# EasyEDA Pro project 赛博樱花灯.epro, board PCB2_1
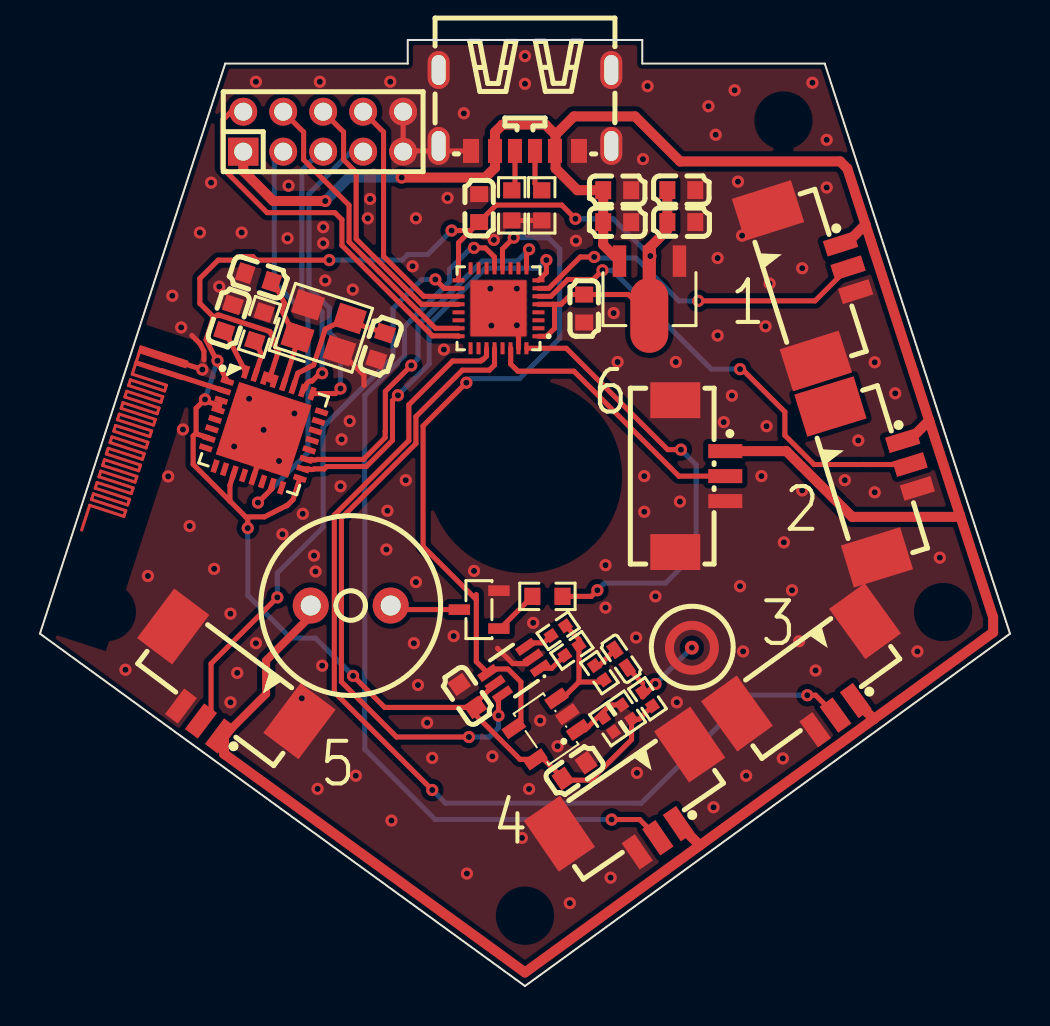
[diagram p14: board, top side]
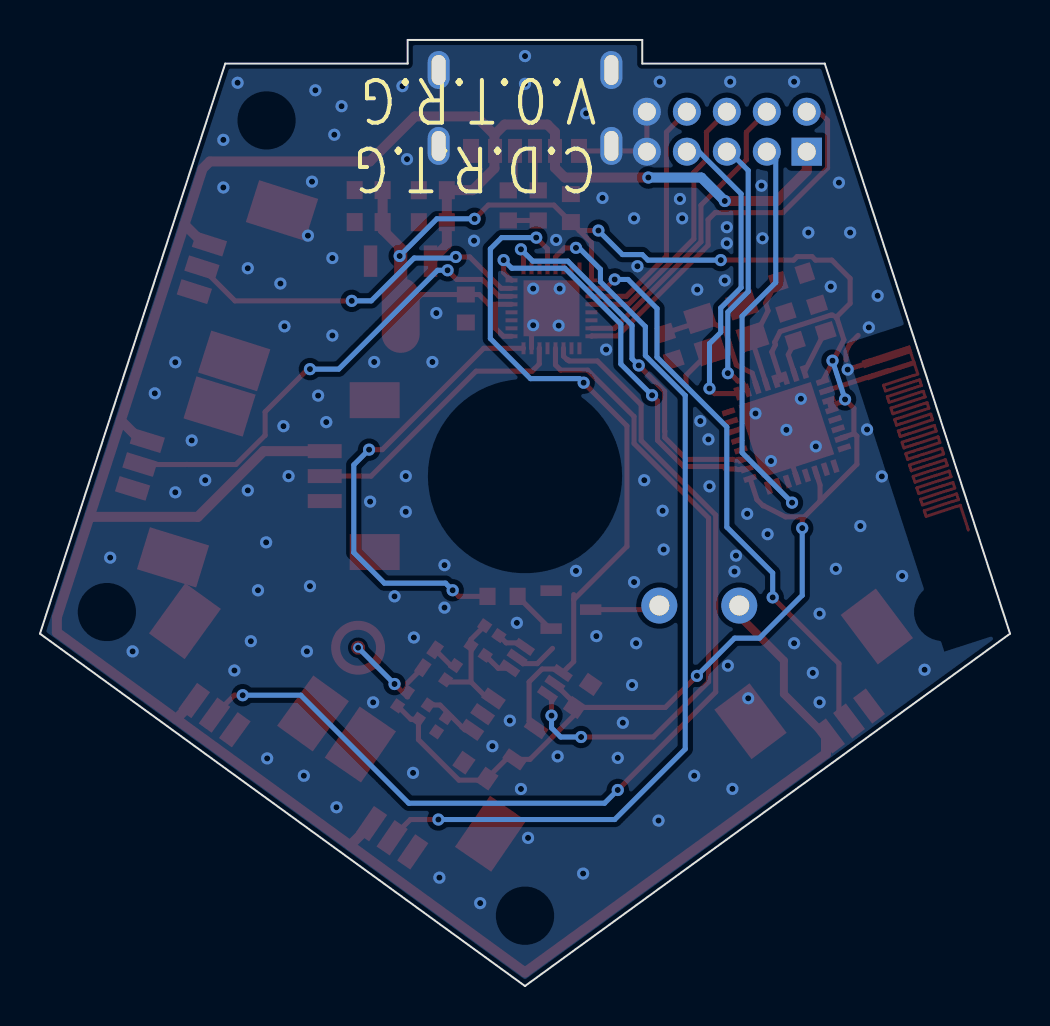
[diagram p15: board, bottom side, seen from below]

Outline 48.54 x 47.35 mm; copper layers: Top Layer, Bottom Layer. Coordinates in mm from the lower left corner of the outline.
Outline path: 0,17.63 24.27,0 48.54,17.63 39.27,46.16 30.14,46.16 30.14,47.35 18.4,47.35 18.4,46.16 9.27,46.16 0,17.63
Stack: Top Layer 0.035mm / Dielectric1 1.51mm FR4 er 4.5 / Bottom Layer 0.035mm

## Design rules (mm)
template: 自定义配置
spacing copperThickness1oz (default): track to track 0.102, other pairs 0.152 to 0.3
spacing copperThickness2oz: track to track 0.203, other pairs 0.152 to 0.3
track width copperThickness1oz (default): min 0.127, default 0.254, max 2.54
track width copperThickness2oz: min 0.203, default 0.254, max 2.54
differential pair differentialPair (default): width min 0.127, default 0.254, max 2.54; gap min 0.152, default 0.152
via viaSize (default): diameter min 0.5, default 0.61, max 10; hole min 0.3, default 0.305, max 6.3

## Placement (name value [footprint] x y rotation side)
ANT1  BT_ANT_2.4G-3  [ANT-2.4G-3]  3.48 23.24 72 top
BUZZER2  2.7kHz  [BUZ-TH_BD9.0-P4.00-D0.6-FD]  15.55 19.04 0 top
C182  1uF  [C0603]  9.44 33.43 252 top
C183  9pF  [C0603]  10.93 35.46 342 top
C184  9pF  [C0603]  17.05 32.01 252 top
C193  10uF  [C0603]  28.88 38.23 180 top
C194  10uF  [C0603]  32.09 38.23 180 top
C215  10uF  [C0402]  29.08 16.38 124.6 top
C216  100nF  [C0603]  21.38 14.52 304.6 top
C217  100nF  [C0603]  26.75 10.78 214.6 top
C218  100nF  [C0603]  28.88 39.83 180 top
C219  100nF  [C0603]  32.09 39.83 180 top
C220  100nF  [C0603]  21.98 38.93 270 top
C221  100nF  [C0603]  27.23 33.91 90 top
CN7  HCZZ0015-3  [CONN-SMD_3P-P1.25-L3.3-W8.8]  8.94 14.44 143.1 top
CN8  HCZZ0015-3  [CONN-SMD_3P-P1.25-L3.3-W8.8]  39.03 35.5 287.6 top
CN9  HCZZ0015-3  [CONN-SMD_3P-P1.25-L3.3-W8.8]  42.13 25.66 287.1 top
CN10  HCZZ0015-3  [CONN-SMD_3P-P1.25-L3.3-W8.8]  38.94 14.76 215.8 top
CN11  HCZZ0015-3  [CONN-SMD_3P-P1.25-L3.3-W8.8]  30.08 8.64 214.4 top
Q1  S8050  [SOT-23-3_L2.9-W1.3-P1.90-LS2.3-BR]  21.98 18.84 0 top
R2  5.1kΩ  [R0603]  23.61 39.07 90 top
R3  5.1kΩ  [R0603]  25.11 39.07 90 top
R133  10kΩ  [R0402]  29.36 13.71 304.6 top
R134  10kΩ  [R0402]  28.45 13.08 124.6 top
R138  1KΩ  [R0402]  27.99 15.68 124.6 top
R139  10kΩ  [R0402]  30.4 14.38 304.6 top
R146  10kΩ  [R0603]  10.98 32.99 252 top
R147  100kΩ  [R0402]  26.62 16.8 214.6 top
R148  50kΩ  [R0402]  25.93 17.78 214.6 top
R149  1kΩ  [R0603]  25.39 19.5 0 top
U1  AT32F415KBU7-4  [QFN-32_L4.0-W4.0-P0.40-BL-EP2.7]  22.95 33.92 90 top
U2  LMV321IDBVR  [SOT-23-5_L3.0-W1.7-P0.95-LS2.8-BR]  25.32 12.86 34.6 top
U97  ESP8285N08  [QFN-32_L5.0-W5.0-P0.50-TL-EP3.7]  11.19 27.83 342 top
U99  26MHz  [CRYSTAL-SMD_4P-L3.2-W2.5-BL]  14.2 32.94 342 top
U102  B4013AM422-42  [MIC-SMD_3P-BD4.0-P1.35_B4013AM423-093]  32.62 16.93 214.6 top
U103  BL1551B  [SC-70-6_L2.1-W1.3-P0.65-LS2.3-BR]  23.72 15.78 34.6 top
U104  AMS1117-3.3  [SOT-89_L4.5-W2.5-P1.50-LS4.2-BR]  30.5 34.92 90 top
U105  WAFER-MX1.25-3PWB  [CONN-SMD_3P-P1.25_WAFER-MX1.25-3PWB]  33.04 25.52 270 top
U107  ZX-PZ2.0-2-5PZZ  [HDR-TH_10P-P2.00-V-M-R2-C5-S2.00]  14.17 42.76 0 top
USB1  TYPE-C 6P  [TYPE-C-SMD_TYPE-C-6P]  24.27 43.82 180 top

## Footprints (pads in the part's own frame, mm; a bottom-side part is the same pattern mirrored in y, then rotated)
ANT-2.4G-3
  oval 1.45x0.15 smd: 1(-0.175,1.2)
  oval 0.15x1.95 smd: 1(0.475,0.3) 1(0.775,0.3) 1(1.075,0.3) 1(1.375,0.3) 1(1.675,0.3) 1(1.974,0.3) 1(2.275,0.3) 1(2.575,0.3) 1(2.874,0.3) 1(3.175,0.3) 1(3.475,0.3) 1(3.775,0.3) 1(4.075,0.3) 1(4.375,0.3) 1(4.675,0.3) 1(4.974,0.3) 1(5.274,0.3) 1(5.574,0.3) 1(5.875,0.3) 1(6.175,0.3) 1(6.475,0.3) 1(6.775,0.3) 1(7.075,0.3) 1(7.375,0.3)
  oval 0.45x0.15 smd: 1(0.625,-0.6) 1(0.924,1.2) 1(1.224,-0.6) 1(1.524,1.2) 1(1.825,-0.6) 1(2.125,1.2) 1(2.425,-0.6) 1(2.725,1.2) 1(3.025,-0.6) 1(3.325,1.2) 1(3.624,-0.6) 1(3.925,1.2) 1(4.224,-0.6) 1(4.524,1.2) 1(4.825,-0.6) 1(5.125,1.2) 1(5.425,-0.6) 1(5.725,1.2) 1(6.024,-0.6) 1(6.324,1.2) 1(6.625,-0.6) 1(6.925,1.2) 1(7.224,-0.6)
  oval 0.8x0.15 smd: 1(7.699,1.2)
  rect 0.25x2.55 smd: 1(7.974,0)
  oval 1.025x0.15 smd: 2(8.362,1.2)
  rect 0.4x2.55 smd: 2(8.675,0)
BUZ-TH_BD9.0-P4.00-D0.6-FD
  round 1.8 hole 1: 1(-2,0) 2(2,0)
C0402
  rect 0.79x0.54 smd: 1(-0.545,0) 2(0.545,0)
C0603
  rect 0.8x0.9 smd: 1(-0.7,0) 2(0.7,0)
CONN-SMD_3P-P1.25-L3.3-W8.8
  rect 0.8x1.6 smd: 1(-1.25,1.475) 2(0,1.475) 3(1.25,1.475)
  rect 2.2x3.1 smd: 4(3.95,-1.475) 5(-3.95,-1.475)
CONN-SMD_3P-P1.25_WAFER-MX1.25-3PWB
  rect 0.7x1.7 smd: 1(-1.25,1.25) 2(0,1.25) 3(1.25,1.25)
  rect 1.8x2.5 smd: 4(-3.8,-1.25) 5(3.8,-1.25)
CRYSTAL-SMD_4P-L3.2-W2.5-BL
  rect 1.4x1.2 smd: 1(-1.1,-0.85) 2(1.1,-0.85) 3(1.1,0.85) 4(-1.1,0.85)
HDR-TH_10P-P2.00-V-M-R2-C5-S2.00
  rect 1.524x1.4 hole 0.9: 1(-4,-1)
  round 1.4 hole 0.9: 2(-4,1) 3(-2,-1) 4(-2,1) 5(0,-1) 6(0,1) 7(2,-1) 8(2,1) 9(4,-1) 10(4,1)
MIC-SMD_3P-BD4.0-P1.35_B4013AM423-093
  round 0.7 smd: 1(0,-0.004)
  custom 2.7x1.588 smd: 2(-0.013,1.121)
  custom 2.7x1.582 smd: 2(0.013,-1.121)
QFN-32_L4.0-W4.0-P0.40-BL-EP2.7
  rect 0.2x0.6 smd: 1(-1.4,-2) 2(-1,-2) 3(-0.6,-2) 4(-0.2,-2) 5(0.2,-2) 6(0.6,-2) 7(1,-2) 8(1.4,-2) 17(1.4,2) 18(1,2) 19(0.6,2) 20(0.2,2) 21(-0.2,2) 22(-0.6,2) 23(-1,2) 24(-1.4,2)
  rect 0.6x0.2 smd: 9(2,-1.4) 10(2,-1) 11(2,-0.6) 12(2,-0.2) 13(2,0.2) 14(2,0.6) 15(2,1) 16(2,1.4) 25(-2,1.4) 26(-2,1) 27(-2,0.6) 28(-2,0.2) 29(-2,-0.2) 30(-2,-0.6) 31(-2,-1) 32(-2,-1.4)
  rect 2.8x2.8 smd: 33(0,0)
QFN-32_L5.0-W5.0-P0.50-TL-EP3.7
  rect 0.65x0.28 smd: 1(-2.478,1.75) 2(-2.478,1.25) 3(-2.478,0.75) 4(-2.478,0.25) 5(-2.478,-0.25) 6(-2.478,-0.75) 7(-2.478,-1.25) 8(-2.478,-1.75) 17(2.478,-1.75) 18(2.478,-1.25) 19(2.478,-0.75) 20(2.478,-0.25) 21(2.478,0.25) 22(2.478,0.75) 23(2.478,1.25) 24(2.478,1.75)
  rect 0.28x0.65 smd: 9(-1.75,-2.478) 10(-1.25,-2.478) 11(-0.75,-2.478) 12(-0.25,-2.478) 13(0.25,-2.478) 14(0.75,-2.478) 15(1.25,-2.478) 16(1.75,-2.478) 25(1.75,2.478) 26(1.25,2.478) 27(0.75,2.478) 28(0.25,2.478) 29(-0.25,2.478) 30(-0.75,2.478) 31(-1.25,2.478) 32(-1.75,2.478)
  rect 3.8x3.8 smd: 33(0,0)
R0402
  rect 0.566x0.54 smd: 1(-0.433,0) 2(0.433,0)
R0603
  rect 0.806x0.864 smd: 1(-0.753,0) 2(0.753,0)
SC-70-6_L2.1-W1.3-P0.65-LS2.3-BR
  rect 1x0.42 smd: 1(1.15,-0.65) 2(1.15,0) 3(1.15,0.65) 4(-1.15,0.65) 5(-1.15,0) 6(-1.15,-0.65)
SOT-23-3_L2.9-W1.3-P1.90-LS2.3-BR
  rect 1.07x0.532 smd: 1(0.99,-0.95) 2(0.99,0.95) 3(-0.99,0)
SOT-23-5_L3.0-W1.7-P0.95-LS2.8-BR
  rect 1.1x0.6 smd: 1(1.3,-0.95) 2(1.3,0) 3(1.3,0.95) 4(-1.3,0.95) 5(-1.3,-0.95)
SOT-89_L4.5-W2.5-P1.50-LS4.2-BR
  rect 1.575x0.672 smd: 1(1.356,-1.5) 3(1.356,1.5)
  custom 5.377x1.9 smd: 2(-1.356,0.009)
TYPE-C-SMD_TYPE-C-6P
  oval 1.1x1.9 hole 0.7x1.5: 7(-4.32,1.775) 7(-4.32,-2.025) 7(4.32,1.775) 7(4.32,-2.025)
  rect 0.7x1.2 smd: A5(-0.5,2.025) A9(1.5,2.025) B5(0.5,2.025) B9(-1.5,2.025)
  rect 0.8x1.2 smd: A12(2.7,2.025) B12(-2.7,2.025)

## Nets
As in the schematic.

Pads without a net: CN9 5; U1 4; U97 5 6 20 21 22 23

## Via types
v1: diameter 0.61, hole 0.305, Top Layer to Bottom Layer, 159 vias
v2: diameter 0.5, hole 0.3, Top Layer to Bottom Layer, 1 via

## Routing (per net, layer and track width the routed paths; a pad name or vN(x,y) marks a point on that pad's centre or on a via; arc(x,y) is an arc through that point)
3V3: length 103.3
  Top Layer w0.254: 10.3,23.48 10.4,23.38 v1(10.4,22.92) ; 10.3,23.48 11.23,23.48 12.32,24.03 12.35,24.03 12.66,24.34 U97.17 ; 10.3,23.48 9.51,24.27 ; C216.2 21.78,13.58 24.02,11.34 25.22,11.34 C217.2 26.26,10.3 27.57,10.3 29.6,12.33 29.6,13.35 29.98,13.35 R139.2 ; C216.2 21.78,14.14 U103.5 ; C216.2 17.25,13.94 v1(15.67,15.52) ; U1.5 25.68,34.12 ; 25.68,34.12 26.08,34.12 26.57,34.61 29.45,34.61 U104.2 ; 25.68,34.12 25.75,34.05 25.75,32.91 25.35,32.52 U1.1 ; 9.51,24.27 7.66,26.11 7.66,27.52 7.81,27.67 ; 9.51,24.27 9.51,25.07 U97.11 ; 7.81,27.67 7.81,28.91 v1(8.26,29.36) 8.3,29.27 8.98,29.05 ; 7.81,27.67 7.86,27.62 8.44,27.44 8.45,27.41 ; U97.1 8.31,32.34 8.66,33.41 8.67,33.41 8.69,33.48 ; v1(20.6,37.81) 21.55,37.81 ; 21.55,37.81 20.95,37.2 U1.17 ; 21.55,37.81 C220.2 22.83,39.09 26.11,39.09 v1(26.79,38.4) ; 8.69,33.48 8,34.16 8,35.41 8.92,36.33 9.73,36.33 9.91,36.51 10.65,36.51 10.83,36.33 v1(14.48,36.33) ; 8.69,33.48 8.9,33.58 8.96,33.56 8.98,33.57 11.5,32.75 11.78,32.22 11.74,32.09 11.92,31.73 11.48,30.37 11.5,30.34 ; 8.98,29.05 8.91,28.84 ; 8.98,29.05 U97.3 ; U97.30 11.5,30.34 ; 11.5,30.34 U97.29
  Top Layer w0.5: U104.2 30.49,36.94 31.39,37.85 C219.2
  Bottom Layer w0.254: v1(10.4,22.92) 10.4,19.55 12.54,17.41 13.78,17.41 v1(15.67,15.52) ; v1(8.88,31.3) 8.25,29.36 v1(8.26,29.36) ; v1(14.48,36.33) 18.13,36.33 18.4,36.61 19.4,36.61 v1(20.6,37.81) ; v1(30.54,36.54) 28.68,38.4 v1(26.79,38.4)
GND: length 18.7
  Top Layer w0.254: 7.6,32.56 8.01,32.15 8.21,31.77 8.21,31.33 ; U107.10 U107.9 18.21,41.79 21.57,41.79 ; U99.2 16.21,30.56 16.21,30.06 ; 10.66,25.4 11.35,27.52 v1(11.19,27.83) ; 22.89,16.9 23.66,16.14 24.36,16.14 24.67,16.44 ; ANT1.2 v1(8.13,30.85) ; U1.31 23.95,32.99 v1(23.86,33.07) ; R2.1 R3.1
  vias: v1(4.28,15.83) v1(5.4,20.52) v1(6.42,25.5) v1(6.62,34.55) v1(7.07,32.96) v1(7.15,27.85) v1(7.49,23.02) v1(8,37.71) v1(8.56,40.21) v1(8.72,20.88) v1(8.97,35.01) v1(9.53,18.63) v1(9.53,14.2) v1(9.72,27) v1(9.87,15.67) v1(10.09,37.71) v1(10.47,29.39) v1(10.81,45.26) v1(10.81,17.16) v1(11.96,26.28) v1(12.13,22.61) v1(12.39,37.42) v1(12.44,40.05) v1(12.73,28.66) v1(13.1,14.4) v1(13.15,23.63) v1(13.71,21.54) v1(13.79,20.75) v1(13.89,9.87) v1(14,45.26) v1(14.17,37.98) v1(14.17,37.17) v1(14.12,16.03) v1(14.27,35.31) v1(15.09,27.36) v1(15.04,25.01) v1(15.5,28.27) v1(15.65,34.85) v1(15.8,10.53) v1(16.41,38.42) v1(16.52,39.39) v1(17.39,23.79) v1(17.33,21.85) v1(17.53,45.26) v1(17.59,8.28) v1(18.3,25.32) v1(18.65,36.02) v1(18.71,17.16) v1(18.81,38.42) v1(18.81,20.22) v1(18.92,15.06) v1(19.37,13.18) v1(19.63,11.42) v1(20.21,31.85) v1(20.39,39.44) v1(20.7,17.51) v1(21.21,43.68) v1(21.36,5.63) v1(21.72,20.78) v1(22.54,34.9) v1(22.59,33.05) v1(22.71,37.34) v1(22.64,11.49) v1(23.86,34.9) v1(24.12,7.41) v1(24.27,46.54) v1(24.27,45.15) v1(24.47,9.86) v1(24.68,18.18) v1(25.03,13.29) v1(25.9,12) v1(26.51,4.15) v1(26.82,37.3) v1(28.3,21.06) v1(28.3,18.94) v1(28.55,5.42) v1(28.71,33.68) v1(28.9,31.23) v1(29.83,17.44) v1(29.87,10.67) v1(30.17,41.38) v1(30.24,25.52) v1(30.24,23.73) v1(30.4,45.04) v1(30.8,19.5) v1(31.82,31.23) v1(31.87,14.2) v1(32.02,24.24) v1(33.45,44.03) v1(33.71,8.95) v1(33.81,42.6) v1(33.91,36.43) v1(33.91,32.56) v1(34.22,28.22) v1(34.62,29.55) v1(34.76,44.83) v1(34.93,40.26) v1(35.03,20.01) v1(35.13,37.56) v1(35.18,16.75) v1(35.34,10.53) v1(36.1,25.52) v1(36.31,33.02) v1(36.36,28.02) v1(36.51,35.16) v1(37.17,11.39) v1(37.22,22.2) v1(37.63,19.81) v1(37.99,17.26) v1(38.14,35.92) v1(38.14,24.81) v1(38.65,45.21) v1(38.81,15.79) v1(39.37,42.35) v1(39.37,39.96) v1(40.27,25.32) v1(40.95,27.3) v1(41.77,31.22) v1(41.77,24.71) v1(42.8,29.66) v1(43.91,16.75) v1(45.03,21.44)
V5: length 145
  Top Layer w0.4: 13.55,18.79 13.55,18.52 11.32,16.29 11.32,14.62 9.21,12.51
  Top Layer w0.5: 41.31,38.11 40.33,37.14 CN8.1 ; 41.31,38.11 44.5,28.31 ; 41.31,38.11 40.4,40.91 40.04,41.27 32.03,41.27 29.78,43.52 26.72,43.52 25.8,42.6 ; 44.5,28.31 46.04,23.56 ; 44.5,28.31 43.48,27.29 43.17,27.29 ; CN7.1 9.21,12.51 9.21,11.62 24.27,0.68 33.02,7.04 ; v1(18.1,40.46) 22.28,40.46 22.77,40.95 22.77,42.74 23.15,43.11 25.29,43.11 25.8,42.6 ; 41.73,13.36 40.82,14.27 CN10.1 ; 41.73,13.36 47.7,17.7 47.7,18.45 46.04,23.56 ; 41.73,13.36 33.02,7.04 ; 31.95,8.13 31.95,8.11 33.02,7.04 ; U104.3 28.18,37.09 C193.2 C218.2 26.89,39.83 25.8,40.92 25.8,42.6 ; 46.04,23.56 45.96,23.48 40.64,23.48 37.35,26.77 U105.1 ; v1(14.27,39.29) 11.67,39.29 10.17,40.79 U107.1
  Bottom Layer w0.5: v1(14.27,39.29) 15.45,40.46 v1(18.1,40.46)
ADC: length 35.9
  Top Layer w0.254: U1.12 23.15,36.89 v1(23.71,37.45) ; v1(21.34,30.2) 19.17,28.03 19.17,22 21.83,19.34 ; U2.4 24.07,13.26 24.07,15.22 23.42,15.87 22.7,15.87 22.5,15.67 U103.4 21.83,16.24 21.83,19.34 ; 21.83,19.34 21.83,19.59
  Bottom Layer w0.254: v1(21.34,30.2) 21.54,30.4 24,30.4 26,32.4 26,36.89 25.44,37.45 v1(23.71,37.45)
AUD_MIC: length 5.9
  Top Layer w0.254: 26.97,15.22 26.14,14.39 U2.3 ; 26.97,15.22 28.13,15.22 R138.1 ; 26.97,15.22 26.97,15.22 26.97,17.35 R148.1
BL1551_ENB: length 31.6
  Top Layer w0.254: 23.14,14.6 22.94,14.4 v1(22.94,13.53) ; v1(21.47,12.46) 17.84,12.46 15.08,15.22 15.08,23.42 18.81,27.15 18.81,28.5 21.14,30.82 22.49,30.82 22.75,31.08 U1.28
  Bottom Layer w0.254: v1(21.47,12.46) 22.49,12.46 22.94,12.92 v1(22.94,13.53)
BUZZER: length 22.9
  Top Layer w0.254: v1(27.89,19.81) 27.59,19.5 R149.2 ; v1(32.07,26.85) 31.41,26.85 26.34,31.92 U1.32
  Bottom Layer w0.254: v1(27.89,19.81) 28.25,20.16 31.31,20.16 32.84,21.69 32.84,26.08 v1(32.07,26.85)
CC1: length 2.1
  Top Layer w0.254: 24.77,41.79 24.77,40.16 R3.2
CC2: length 2
  Top Layer w0.254: 23.77,41.79 23.77,39.98 R2.2
ESP_U0_RX: length 15.5
  Top Layer w0.254: 13.66,29.65 14.78,29.65 v1(15.04,29.91)
  Bottom Layer w0.254: U107.7 15.57,41.76 13.46,39.65 13.46,34.95 14.48,33.93 14.48,32.71 15.04,32.15 v1(15.04,29.91)
ESP_U0_TX: length 13.4
  Top Layer w0.254: v1(14.12,30.67) 14.01,30.67 13.62,30.28 arc(13.44,30.24) 13.32,30.09 13.27,29.93 U97.26
  Bottom Layer w0.254: U107.5 14.04,41.76 13.1,40.82 13.1,34.75 14.12,33.73 v1(14.12,30.67)
IO0: length 20.7
  Top Layer w0.254: v1(10.91,24.19) 11.62,24.9 U97.15
  Bottom Layer w0.254: U107.3 11.72,41.31 11.72,35.21 13.41,33.53 13.41,26.69 v1(10.91,24.19)
IO9: length 20
  Top Layer w0.254: v1(17.91,29.57) 17.64,29.29 17.64,27.31 16.33,26 14.35,26 14.23,25.88 13.74,25.88 ; U97.18 13.42,25.88 13.5,25.86 arc(13.61,25.85) 13.72,25.88 ; v1(25.34,36.33) 25.34,35.71 U1.8
  Bottom Layer w0.254: v1(25.34,36.33) 24.93,35.92 22.28,35.92 19.48,33.12 19.48,31.13 v1(17.91,29.57)
IO10: length 18.9
  Top Layer w0.254: v1(18.58,31.06) 17.28,29.76 17.28,27.78 17.28,27.77 17.28,27.45 16.19,26.36 13.88,26.36 arc(13.77,26.32) 13.65,26.33 13.58,26.36 13.32,26.36 ; v1(24.47,36.87) 24.35,36.74 U1.9
  Bottom Layer w0.254: v1(18.58,31.06) 18.92,31.39 18.92,33.07 22.13,36.28 23.88,36.28 v1(24.47,36.87)
IO_DBG: length 13.5
  Top Layer w0.254: U1.20 19.09,34.12 15.82,37.39 15.82,40.72 15.19,41.35 15.19,42.74 U107.6
LOG_TX: length 12.2
  Top Layer w0.254: U1.19 19.2,34.52 17.19,36.52 17.19,42.74 U107.8
SW_CLK: length 19.7
  Top Layer w0.254: U107.2 9.56,43.76 9.13,43.33 9.13,40.94 11.37,38.71 14.76,38.71 15.11,38.35 15.11,37.07 19.64,32.54 20.92,32.54 U1.24
SW_SDA: length 15.1
  Top Layer w0.254: U107.4 13.19,42.74 13.19,41.35 15.47,39.08 15.47,37.24 19.79,32.92 U1.23
WS0: length 28.7
  Top Layer w0.254: v1(11.88,19.45) 8.56,16.14 8.56,13.77 CN7.2 ; v1(19.78,35.36) 20.23,34.92 U1.18
  Bottom Layer w0.254: v1(19.78,35.36) 19.12,35.36 17.66,33.91 17.66,31.47 14.17,27.98 14.17,22.97 11.88,20.67 v1(11.88,19.45)
WS1: length 17.7
  Top Layer w0.254: U1.7 25.47,34.92 27.03,36.49 v1(27.73,36.49) ; v1(32.94,34.29) 38.78,34.29 CN8.2
  Bottom Layer w0.254: v1(27.73,36.49) 27.79,36.43 29.82,36.43 31.96,34.29 v1(32.94,34.29)
WS2: length 23.8
  Top Layer w0.254: v1(28.15,35.82) 27.69,35.36 26.41,35.36 25.57,34.52 U1.6 ; v1(35.03,30.87) 35.13,30.87 37.28,28.73 37.28,27.56 38.74,26.1 41.11,26.1 arc(41.19,26.1) 41.27,26.1 CN9.2
  Bottom Layer w0.254: v1(28.15,35.82) 28.65,35.82 33.59,30.87 v1(35.03,30.87)
WS3: length 51.2
  Top Layer w0.254: v1(38.4,14.55) 38.81,14.55 CN10.2 ; v1(19.63,9.81) 14.73,14.71 14.73,23.57 18.46,27.3 18.46,29.09 20.65,31.28 22.06,31.28 22.12,31.34 22.16,31.34 22.35,31.52 U1.27
  Bottom Layer w0.254: v1(38.4,14.55) 35.49,14.55 30.08,9.15 20.29,9.15 v1(19.63,9.81)
WS4: length 45.7
  Top Layer w0.254: CN11.2 30.01,8.33 v1(28.61,8.33) ; U1.13 22.75,36.48 22.28,36.94 v1(21.72,36.94)
  Bottom Layer w0.254: v1(28.61,8.33) 19.78,8.33 16.25,11.86 16.25,29.56 18.25,31.55 18.25,33 20.5,35.25 20.5,35.87 21.57,36.94 v1(21.72,36.94)
WS5: length 13.9
  Top Layer w0.254: U105.2 31.97,25.52 26.72,30.77 23.91,30.77 23.56,31.13 23.56,31.91 U1.30
$1N1069: length 3.3
  Top Layer w0.254: 6.08,30.81 U97.2
$1N1076: length 6.7
  Top Layer w0.254: 17.26,32.68 15.2,33.35 14.28,32.87 13.69,31.08 12.9,30.67 12.67,29.96
$1N1080: length 2.3
  Top Layer w0.254: 9.22,32.76 9.26,32.75 U97.32
$1N1081: length 5.7
  Top Layer w0.254: 11.71,35.21 12.23,34.18 12.11,33.79 12.89,32.26 U97.28 ; 11.71,35.26 11.6,35.29
$1N1083: length 1.8
  Top Layer w0.254: 10.77,30.58 11.1,31.6 10.75,32.28
$1N1545: length 5
  Top Layer w0.254: 29.39,15.93 30.15,15.16 ; v1(30.8,15.12) 30.16,14.48 30.15,14.48 30.15,14.91
  Bottom Layer w0.254: v2(32.62,16.93) 30.8,15.12 v1(30.8,15.12)
$1N1546: length 1.3
  Top Layer w0.254: R138.2 27.98,16.04 C215.2
$1N2130: length 2.7
  Top Layer w0.254: 29.11,14.06 28.52,14.06 27.28,12.82 26.93,12.82
$1N2304: length 1.5
  Top Layer w0.254: U103.1 25.61,15.9 R147.2
$1N2327: length 1.5
  Top Layer w0.254: U103.3 24.39,16.97 24.59,17.17 25.21,17.17 25.58,17.54
$1N9735: length 2.3
  Top Layer w0.254: Q1.1 23.03,17.89 R149.1
$1N9739: length 3.5
  Top Layer w0.254: Q1.3 17.6,18.84 17.55,18.79

## Copper pours and planes (outline as drawn; the poured copper is in the pictures)
GND on Top Layer: -3.42,52.65 55.18,52.65 55.18,-5.64 -3.42,-5.64
GND on Bottom Layer: -6.23,51.78 56.3,51.78 56.3,-6.05 -6.23,-6.05

## Text on the board
Bottom Silkscreen Layer: C.D.R.T.G / V.0.T.R.G
Top Silkscreen Layer: 5 | 4 | 6 | 1 | 3 | 2
